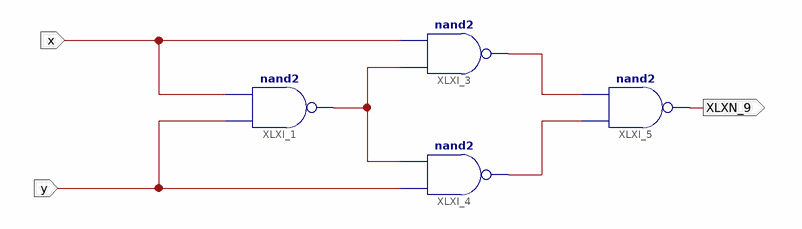
[diagram p0: schematic sheet 1]
// Xilinx ISE schematic schmu.sch (spartan3e) as structural Verilog: 4 symbols, 3 ports
module schmu (
  input  x,
  input  y,
  output XLXN_9
);

  wire XLXN_1, XLXN_2, XLXN_3;

  nand XLXI_1 (XLXN_1, y, x);
  nand XLXI_3 (XLXN_2, XLXN_1, x);
  nand XLXI_4 (XLXN_3, y, XLXN_1);
  nand XLXI_5 (XLXN_9, XLXN_3, XLXN_2);
endmodule
